# EAGLE design dimmer.light (EAGLE 7.3.0)
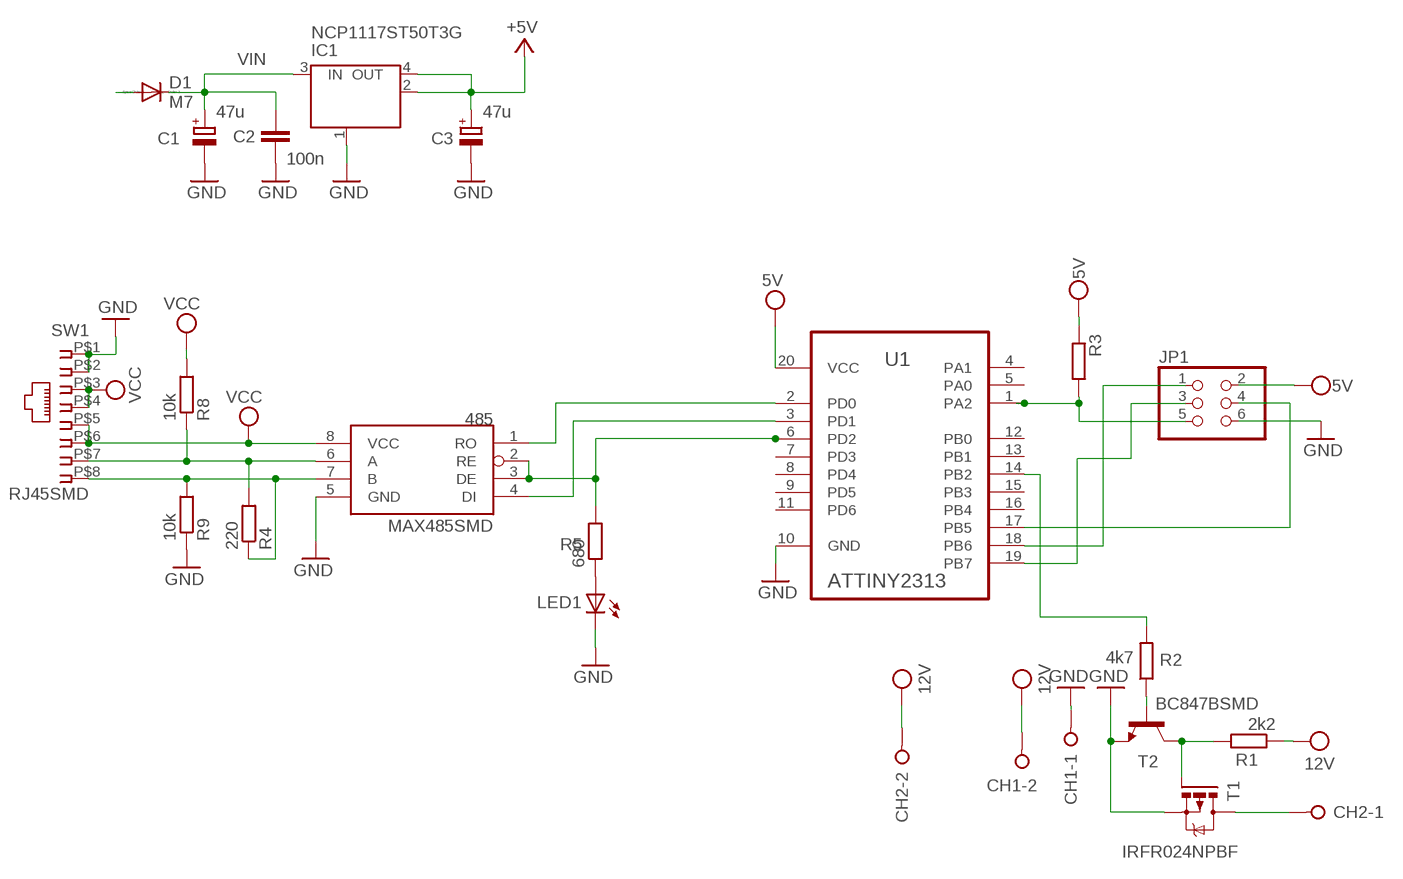
[diagram p0: schematic, sheet 1]

## Parts
485  MAX485SMD  [SO08]
C1  47u  CPOL-EUD  [PANASONIC_D]
C2  100n  C-EUC1206  [C1206]
C3  47u  CPOL-EUD  [PANASONIC_D]
CH1  W237-02P  [W237-132]
CH2  W237-02P  [W237-132]
D1  M7  DIODE-SMB  [SMB]
IC1  NCP1117ST50T3G  MC33269ST-3.3T3  [SOT223]
JP1  PINHD-2X3  [2X03]
LED1  LEDSML1206  [SML1206]
R1  2k2  R-EU_R1206  [R1206]
R2  4k7  R-EU_R1206  [R1206]
R3  R-EU_R1206  [R1206]
R4  220  R-EU_R1206  [R1206]
R5  680  R-EU_R1206  [R1206]
R8  10k  R-EU_R1206  [R1206]
R9  10k  R-EU_R1206  [R1206]
SW1  RJ45SMD  [RJ45SMD]
T1  IRFR024NPBF  IRFR5305  [D-PAK_TO252AA]
T2  BC847BSMD  [SOT23]
U1  ATTINY2313  ATTINY2313-20SU  [SOIC127P1032X265-20N]

## Nets
A: 485.6(A) R4.2 R8.1 SW1.P$7
B: 485.7(B) R4.1 R9.2 SW1.P$8
GND: 485.5(GND) C1.- C2.2 C3.- CH1.1 IC1.1(GND/ADJ) JP1.6 LED1.C R9.1 SW1.P$1 SW1.P$2 T1.3(S) T2.2(E) U1.10(GND)
N$1: R2.1 T2.1(B)
N$5: JP1.3 U1.19(PB7)
N$6: JP1.1 U1.18(PB6)
N$7: JP1.4 U1.17(PB5)
N$9: R1.2 T1.1(G) T2.3(C)
N$13: R2.2 U1.14(PB2)
N$14: CH2.1 T1.4(D)
N$18: 485.4(DI) U1.3(PD1)
N$19: 485.1(RO) U1.2(PD0)
N$20: 485.2(RE) 485.3(DE) R5.2 U1.6(PD2)
N$27: JP1.5 R3.2 U1.1(PA2)
N$48: LED1.A R5.1
PWRIN [power]: CH1.2 CH2.2 D1.A R1.1 ; supply symbol labelled 12V
VCC+5V: 485.8(VCC) C3.+ IC1.2(OUT) IC1.4(OUT) JP1.2 R3.1 R8.2 SW1.P$5 SW1.P$6 U1.20(VCC) ; supply symbol labelled 5V, +5V, VCC
VIN [power]: C1.+ C2.1 D1.C IC1.3(IN) SW1.P$3 SW1.P$4 ; supply symbol labelled VCC
Unconnected: U1.4(PA1) U1.5(PA0) U1.7(PD3) U1.8(PD4) U1.9(PD5) U1.11(PD6) U1.12(PB0) U1.13(PB1) U1.15(PB3) U1.16(PB4)

## Library data of the parts
485 = maxim:MAX485SMD
C1 C3 = rcl:CPOL-EU: POLARIZED CAPACITOR, European symbol
C2 = rcl:C-EU: CAPACITOR, European symbol
CH1 CH2 = con-wago-508:W237-02P: WAGO SREW CLAMP; OC_FARNELL: unknown; OC_NEWARK: unknown
D1 = diode:DIODE-: DIODE
IC1 = linear:MC33269ST*: Adjustable Output Low Dropout Voltage Regulator 800 mA Source: http://www.onsemi.com/pub/Collateral/MC33269-D.PDF
JP1 = pinhead:PINHD-2X3: PIN HEADER
LED1 = led:LED: LED OSRAM: - CHIPLED LG R971, LG N971, LY N971, LG Q971, LY Q971, LO R971, LY R971 LH N974, LH R974 LS Q976, LO Q976, LY Q976 LO Q996 - Hyper CHIPLED LW Q18S LB Q993, LB Q99A, LB R99A - SideLED LS A670, LO A670, LY A670, LG A670, LP A670 LB A673, LV A673, LT A673, LW A673 LH A674 LY A675 LS A676, LA A676, LO A676, LY A676, LW A676 LS A679, LY A679, LG A679 - Hyper Micro SIDELED® LS Y876, LA Y876, LO Y876, LY Y876 LT Y87S - SmartLED LW L88C, LW L88S LB L89C, LB L89S, LG L890 LS L89K, LO L89K, LY L89K LS L896, LA L896, LO L896, LY L896 - TOPLED LS T670, LO T670, LY T670, LG T670, LP T670 LSG T670, LSP T670, LSY T670, LOP T670, LYG T670 LG T671, LOG T671, LSG T671 LB T673, LV T673, LT T673, LW T673 LH T674 LS T676, LA T676, LO T676, LY T676, LB T676, LH T676, LSB T676, LW T676 LB T67C, LV T67C, LT T67C, LS T67K, LO T67K, LY T67K, LW E67C LS E67B, LA E67B, LO E67B, LY E67B, LB E67C, LV E67C, LT E67C LW T67C LS T679, LY T679, LG T679 LS T770, LO T770, LY T770, LG T770, LP T770 LB T773, LV T773, LT T773, LW T773 LH T774 LS E675, LA E675, LY E675, LS T675 LS T776, LA T776, LO T776, LY T776, LB T776 LHGB T686 LT T68C, LB T68C - Hyper Mini TOPLED® LB M676 - Mini TOPLED Santana® LG M470 LS M47K, LO M47K, LY M47K Source: http://www.osram.convergy.de LUXEON: - LUMILED® LXK2-PW12-R00, LXK2-PW12-S00, LXK2-PW14-U00, LXK2-PW14-V00 LXK2-PM12-R00, LXK2-PM12-S00, LXK2-PM14-U00 LXK2-PE12-Q00, LXK2-PE12-R00, LXK2-PE12-S00, LXK2-PE14-T00, LXK2-PE14-U00 LXK2-PB12-K00, LXK2-PB12-L00, LXK2-PB12-M00, LXK2-PB14-N00, LXK2-PB14-P00, LXK2-PB14-Q00 LXK2-PR12-L00, LXK2-PR12-M00, LXK2-PR14-Q00, LXK2-PR14-R00 LXK2-PD12-Q00, LXK2-PD12-R00, LXK2-PD12-S00 LXK2-PH12-R00, LXK2-PH12-S00 LXK2-PL12-P00, LXK2-PL12-Q00, LXK2-PL12-R00 Source: www.luxeon.com KINGBRIGHT: KA-3528ASYC Source: www.kingbright.com
R1-R5 R8 R9 = rcl:R-EU_: RESISTOR, European symbol
SW1 = con-tycoelectronics:RJ45SMD
T1 = transistor-power:IRF?5305: HEXFET Power MOSFET Source: http://www.irf.com/product-info/datasheets/data/irfr5305pbf.pdf
T2 = transistor-npn:BC847*: NPN Transistor
U1 = Atmel.By.element14:ATTINY2313-20SU: 8-bit Microcontroller with 2K Bytes In-System Programmable Flash; MPN: ATTINY2313-20SU; OC_FARNELL: 9171606; OC_NEWARK: 96K6526; PACKAGE: SOIC-20; SUPPLIER: Atmel

## Net classes
0 default: width 0.406 mm, drill 0.406 mm, clearance 0.406 mm
1 power: width 0.61 mm, drill 0.406 mm, clearance 0.203 mm
3 power usb: width 0.508 mm, drill 0.406 mm, clearance 0.203 mm

## Board
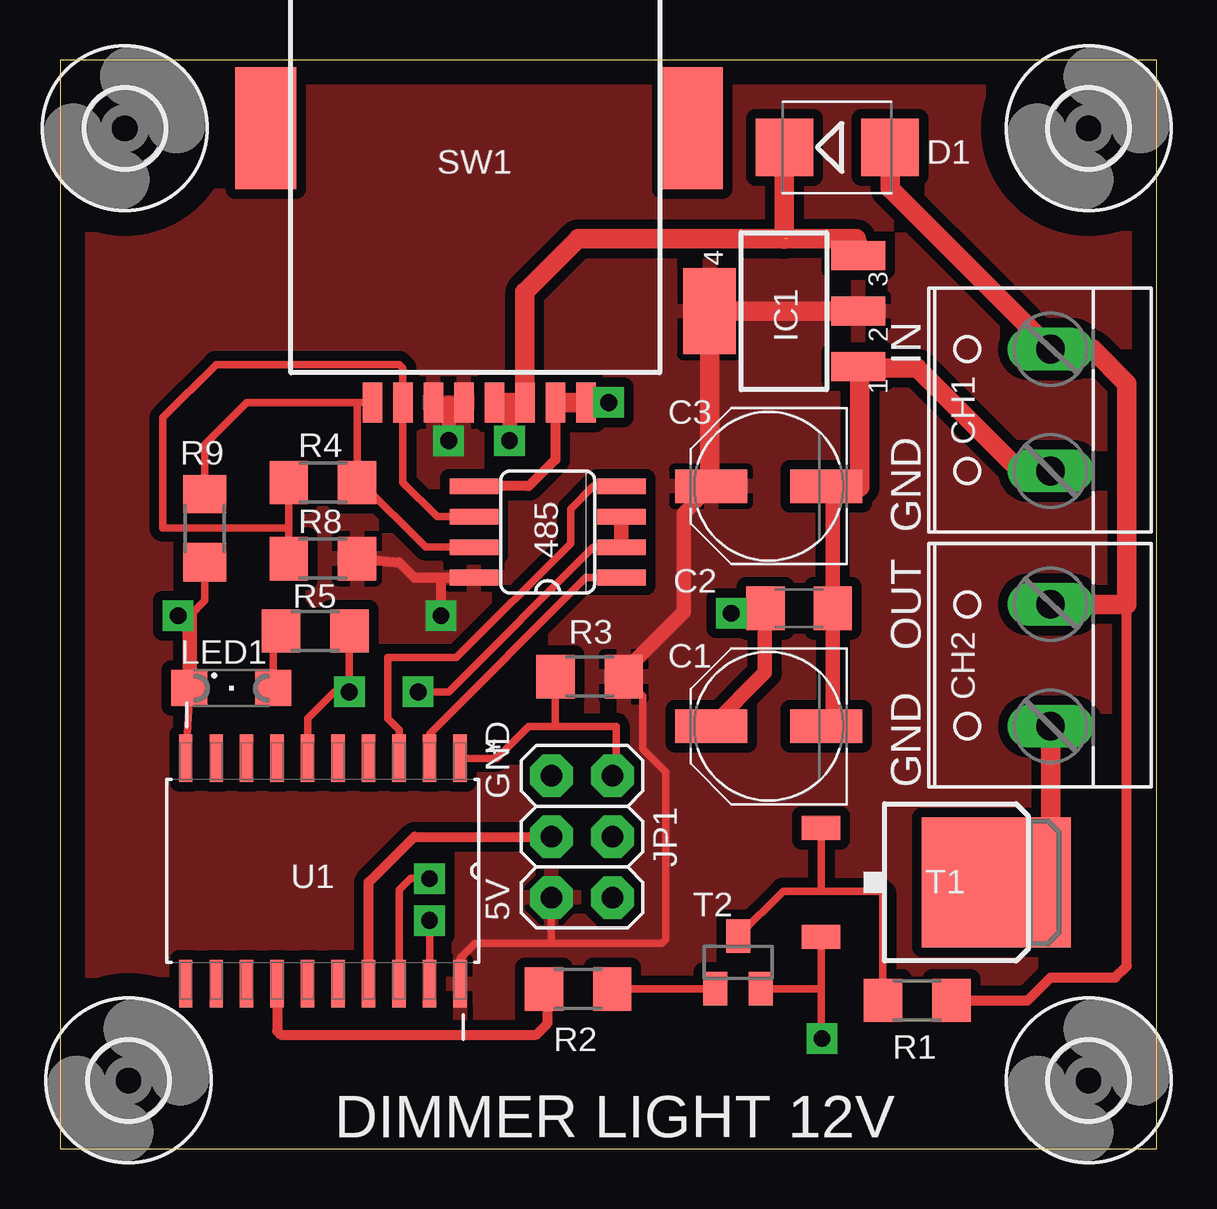
[diagram p1: board, top side]
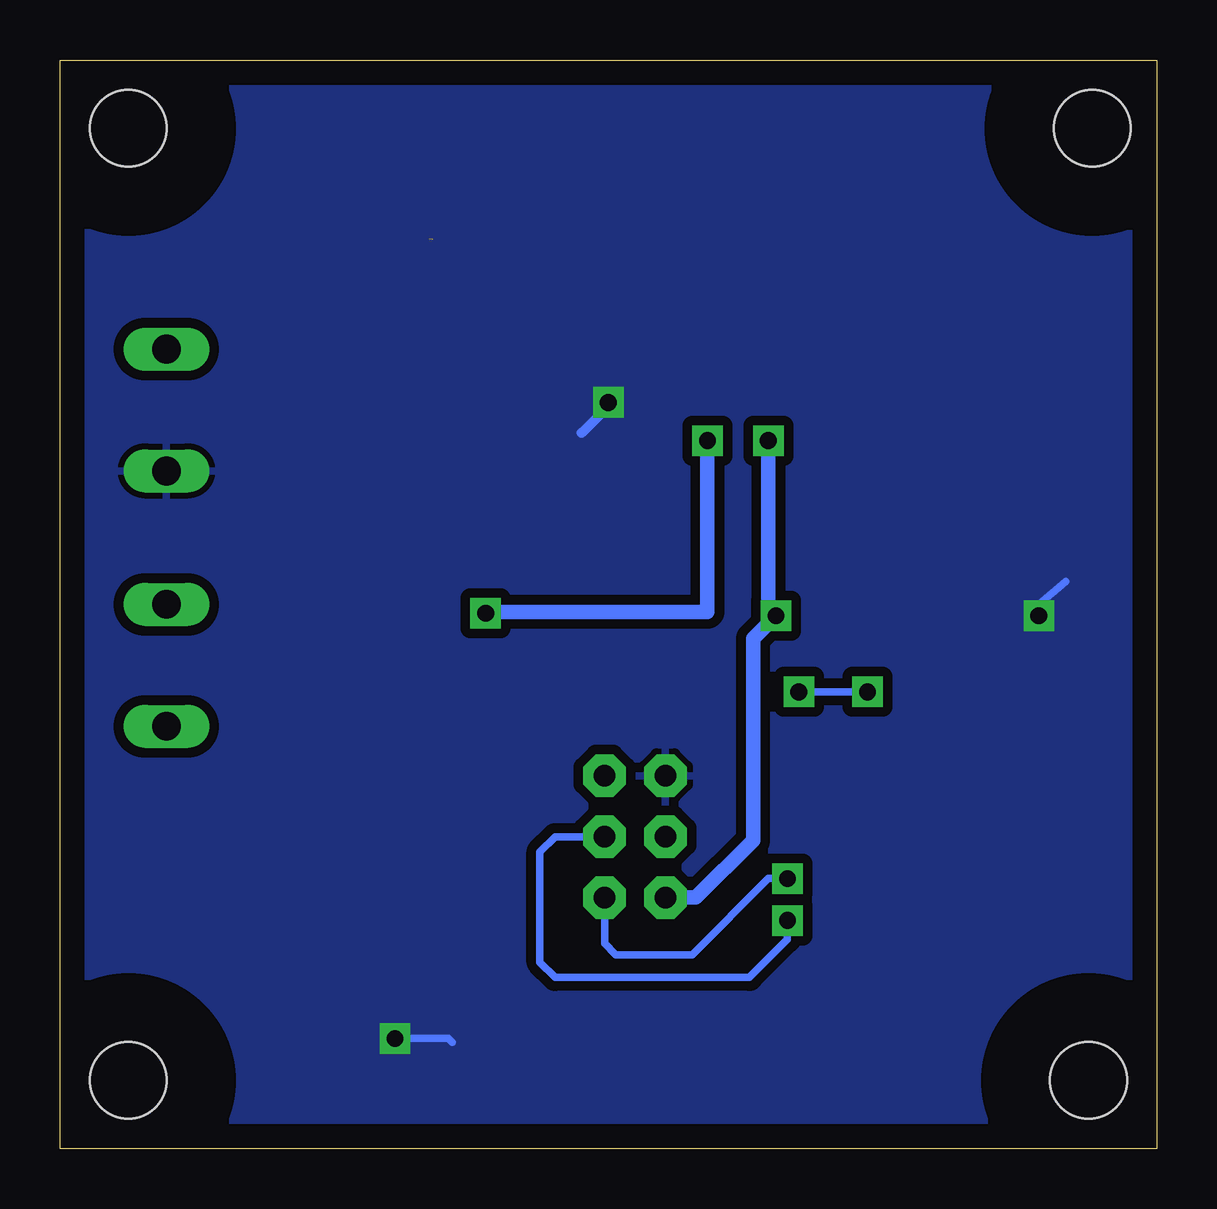
[diagram p2: board, bottom side, seen from below]

Size 45.71 x 45.39 mm. Coordinates in mm from the lower left corner, seen from the top.
Outline: 0,0 45.71,0 45.71,45.39 0,45.39 0,0
Copper layers (1*16): Top 0.035mm / dielectric 1.5mm / Bottom 0.035mm
Design rules "default": minimum track width 10mil, minimum drill 24mil, track to track 8mil, track to pad 8mil, pad to pad 8mil, via to via 8mil, smd to smd 8mil, copper to edge 40mil, drill to drill 8mil, minimum pad ring 10mil, minimum via ring 8mil, stop-mask expansion 4mil, vias tented up to drill 0mil, thermal gap 10mil

### Footprints (pad centres in the part's own frame; a part is rotated, then mirrored left to right if it is on the bottom)
SO08 = smd 0.66 x 2.032: 1 -1.905,-3.073; 2 -0.635,-3.073; 3 0.635,-3.073; 4 1.905,-3.073; 5 1.905,3.073; 6 0.635,3.073; 7 -0.635,3.073; 8 -1.905,3.073
PANASONIC_D = smd 3 x 1.4: + 2.4,0; - -2.4,0
C1206 = smd 1.6 x 1.8: 1 -1.4,0; 2 1.4,0
W237-132 = drill 1.194 long: 1 -2.54,-0.635; 2 2.54,-0.635
SMB = smd 2.4 x 2.4: A 2.2,0; C -2.2,0
SOT223 = smd 1.219 x 2.235: 1 -2.311,-3.099; 2 0,-3.099; 3 2.311,-3.099 | smd 3.6 x 2.2: 4 0,3.099
2X03 = drill 0.9 pad 1.778 octagon: 1 -2.54,-1.27; 2 -2.54,1.27; 3 0,-1.27; 4 0,1.27; 5 2.54,-1.27; 6 2.54,1.27
SML1206 = smd 1.5 x 1.5: A 1.75,0; C -1.75,0
R1206 = smd 1.6 x 1.803: 1 -1.422,0; 2 1.422,0
RJ45SMD = smd 0.813 x 1.676: P$1 -4.445,8.255; P$2 -3.175,8.255; P$3 -1.905,8.255; P$4 -0.635,8.255; P$5 0.635,8.255; P$6 1.905,8.255; P$7 3.175,8.255; P$8 4.445,8.255 | smd 2.54 x 5.08: P$9 8.89,-3.175; P$10 -8.89,-3.175
D-PAK_TO252AA = smd 1 x 1.6: 1 -2.28,-4.8; 3 2.28,-4.8 | smd 5.4 x 6.2: 4 0,2.5
SOT23 = smd 1 x 1.4: 1 -0.95,-1.1; 2 0.95,-1.1; 3 0,1.1
SOIC127P1032X265-20N = smd 1.981 x 0.559: 1 -4.699,5.715; 2 -4.699,4.445; 3 -4.699,3.175; 4 -4.699,1.905; 5 -4.699,0.635; 6 -4.699,-0.635; 7 -4.699,-1.905; 8 -4.699,-3.175; 9 -4.699,-4.445; 10 -4.699,-5.715; 11 4.699,-5.715; 12 4.699,-4.445; 13 4.699,-3.175; 14 4.699,-1.905; 15 4.699,-0.635; 16 4.699,0.635; 17 4.699,1.905; 18 4.699,3.175; 19 4.699,4.445; 20 4.699,5.715
3,2 = hole 3.2: 0,0

### Placement (x,y rotation side)
485  20.32,25.72 90 top
C1  29.53,17.62 180 top
C2  30.8,22.54 0 top
C3  29.53,27.62 180 top
CH1  40.64,30.8 90 top
CH2  40.64,20.16 90 top
D1  32.39,41.75 0 top
IC1  30.16,34.93 90 top
JP1  21.75,13.02 90 top
LED1  7.14,19.21 0 top
R1  35.72,6.19 180 top
R2  21.59,6.67 180 top
R3  22.07,19.68 180 top
R4  10.95,27.78 180 top
R5  10.64,21.59 0 top
R8  10.95,24.61 0 top
R9  6.03,25.88 90 top
SW1  17.46,39.37 180 top
T1  36.51,11.11 270 top
T2  28.26,7.78 0 top
U1  10.95,11.59 270 top
U$1  [3,2]  2.86,2.86 0 top
U$2  [3,2]  42.86,2.86 0 top
U$3  [3,2]  2.7,42.55 0 top
U$4  [3,2]  42.86,42.55 0 top

### Tracks (layer width: path | path; a pad name or v marks a point on that pad's centre or on a via)
A
  Top 0.305: 9.53,25.88 9.53,27.46 R4.2 | R8.1 9.53,24.44 9.53,25.88 | 9.53,25.88 4.29,25.88 4.29,30.48 6.51,32.7 14.13,32.7 14.29,32.54 SW1.P$7 14.29,27.78 15.72,26.35 485.6
B
  Top 0.305: SW1.P$8 12.38,31.11 | 12.38,31.11 7.78,31.11 6.03,29.37 R9.2 | 12.38,31.11 R4.1 12.54,27.78 15.24,25.08 485.7
GND  (via drill 0.7 pad 1.27)
  Top 0.305: LED1.C 5.4,18.99 U1.10 | v4.92,22.22 5.4,22.22 6.03,22.86 R9.1 | T2.2 31.71,6.67 | T1.3 31.71,6.67 | 31.71,6.67 31.71,4.64 v31.75,4.6
  Top 0.406: SW1.P$2 20.64,28.73 19.53,27.62 485.5 | SW1.P$1 v22.86,31.11
  Top 0.61: 31.93,17.46 C1.- | C2.2 32.25,22.7 | 32.04,17.51 C1.- | 5.4,22.22 5.4,19.37 LED1.C | C2.2 32.2,27.35 C3.- | C2.2 32.2,17.57 C1.-
  Top 0.813: CH1.1 39.85,28.42 35.72,32.54 33.33,32.54 | 33.33,32.54 IC1.1 | 33.33,32.54 33.33,27.6 C3.- | SW1.P$2 SW1.P$1
  Bottom 0.305: v4.92,22.22 4.92,22.7 3.81,23.65 | v31.75,4.6 29.53,4.6 29.37,4.45
  Bottom 0.406: v22.86,31.11 23.02,30.8 23.97,29.85
  pour Bottom (isolate 0.406): -0.16,45.4 45.72,45.4 45.72,0.16 -0.16,0.16
N$1
  Top 0.305: R2.1 27.3,6.67 T2.1
N$5  (via drill 0.7 pad 1.27)
  Top 0.305: U1.19 v15.4,9.52
  Bottom 0.305: v15.4,9.52 15.4,8.73 16.99,7.14 25.08,7.14 25.72,7.78 25.72,12.38 25.08,13.02 JP1.3
N$6  (via drill 0.7 pad 1.27)
  Top 0.305: U1.18 14.13,10.8 14.61,11.27 v15.4,11.27
  Bottom 0.305: 23.18,10.32 JP1.1 23.02,8.57 22.54,8.1 19.37,8.1 16.19,11.27 v15.4,11.27
N$7
  Top 0.406: U1.17 12.86,11.11 14.76,13.02 JP1.4
N$9
  Top 0.305: T1.1 31.71,10.75 | 31.71,10.75 34.18,10.75 34.29,10.64 R1.2 | 31.71,10.75 30.12,10.75 T2.3
N$13
  Top 0.406: U1.14 9.05,4.92 9.21,4.76 19.84,4.76 20.32,5.24 20.32,6.52 R2.2
N$14
  Top 0.813: CH2.1 41.28,12.11 T1.4
N$18
  Top 0.305: 485.4 22.23,27.62 21.27,26.67 21.27,25.24 16.51,20.48 13.65,20.48 13.65,17.94 14.13,17.46 U1.3
N$19
  Top 0.305: U1.2 15.4,17.3 21.91,23.81 485.1
N$20  (via drill 0.7 pad 1.27)
  Top 0.305: 485.2 22.23,25.08 16.19,19.05 v14.92,19.05 | U1.6 10.32,17.94 11.43,19.05 v12.06,19.05 R5.2
  Top 0.61: 485.3 485.2
  Bottom 0.305: 12.38,19.05 v12.06,19.05 v14.92,19.05
N$27
  Top 0.305: JP1.5 23.17,15.71 23.17,17.62 20.64,17.62 | U1.1 18.19,16.29 19.53,17.62 20.64,17.62 | R3.2 20.64,17.62
N$48
  Top 0.305: R5.1 8.89,21.59 LED1.A
PWRIN
  Top 0.406: R1.1 40.32,6.19 41.28,7.14 43.97,7.14 44.45,7.62 44.45,22.7
  Top 0.813: CH2.2 44.45,22.7 44.45,31.91 43.02,33.34 CH1.2 34.58,40.03 D1.A
VCC+5V  (via drill 0.7 pad 1.27)
  Top 0.305: R3.1 24.29,18.88 24.29,16.67 25.24,15.72 25.24,8.73 25.08,8.57 20.48,8.57 | JP1.2 20.48,8.57 | 20.48,8.57 17.3,8.57 16.67,7.94 U1.20
  Top 0.406: SW1.P$6 16.19,31.11 SW1.P$5 | 15.72,23.81 14.76,23.81 14.13,24.45 R8.2 | 15.72,23.81 485.8 | v15.88,22.22 15.88,23.65 15.72,23.81
  Top 0.61: 16.19,31.11 v16.19,29.53 | R3.1 23.49,19.88 25.99,22.38 25.99,26.48 C3.+
  Top 0.813: IC1.2 IC1.4 27.06,28 C3.+
  Bottom 0.61: 20.32,10.48 JP1.2 19.21,10.48 16.83,12.86 16.83,21.27 v15.88,22.22 16.19,22.54 v16.19,29.53
  pour Top (isolate 0.406): 0.16,45.4 0.16,2.5 2.34,0 45.56,0 45.56,42.9 43.06,45.4
VIN  (via drill 0.7 pad 1.27)  (1 unrouted)
  Top 0.61: 26.97,17.44 C1.+ 29.37,19.86 29.37,21.88 C2.1 29.34,22.33 v27.97,22.33 | v18.73,29.53 18.73,31.11
  Top 0.813: D1.C 30.18,37.92 | SW1.P$4 18.73,31.11 SW1.P$3 19.37,35.72 21.59,37.94 30,37.94 30.16,38.1 30.32,37.94 33.18,37.94 33.18,37.78 33.26,37.7 IC1.3
  Bottom 0.61: v18.73,29.53 18.73,22.38 27.92,22.38 v27.97,22.33

### Text on the board
tNames: IN | GND | OUT | GND | GND | 5V | DIMMER LIGHT 12V